# EAGLE schematic IHM_NAV_BUTTON (EAGLE 9.5.2)
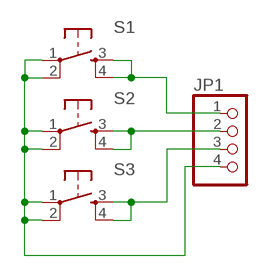
[diagram p0: schematic, sheet 1]

## Parts
JP1  PINHD-1X04_2.54-SMD-90°  [1X04SMD/90]
S1  6MM_SWITCH6MM_SWITCH  [6MM_SWITCH]
S2  6MM_SWITCH6MM_SWITCH  [6MM_SWITCH]
S3  6MM_SWITCH6MM_SWITCH  [6MM_SWITCH]

## Nets
N$1: JP1.1 S1.3(S) S1.4(S1)
N$2: JP1.2 S2.3(S) S2.4(S1)
N$3: JP1.3 S3.3(S) S3.4(S1)
N$4: JP1.4 S1.1(P) S1.2(P1) S2.1(P) S2.2(P1) S3.1(P) S3.2(P1)

## Library data of the parts
JP1 = pinhead-2:PINHD-1X04: PIN HEADER
S1-S3 = fab:6MM_SWITCH: OMRON SWITCH